# Altium schematic sheet Power.SchDoc
size A4; SheetNumber: 2; SheetTotal: 6
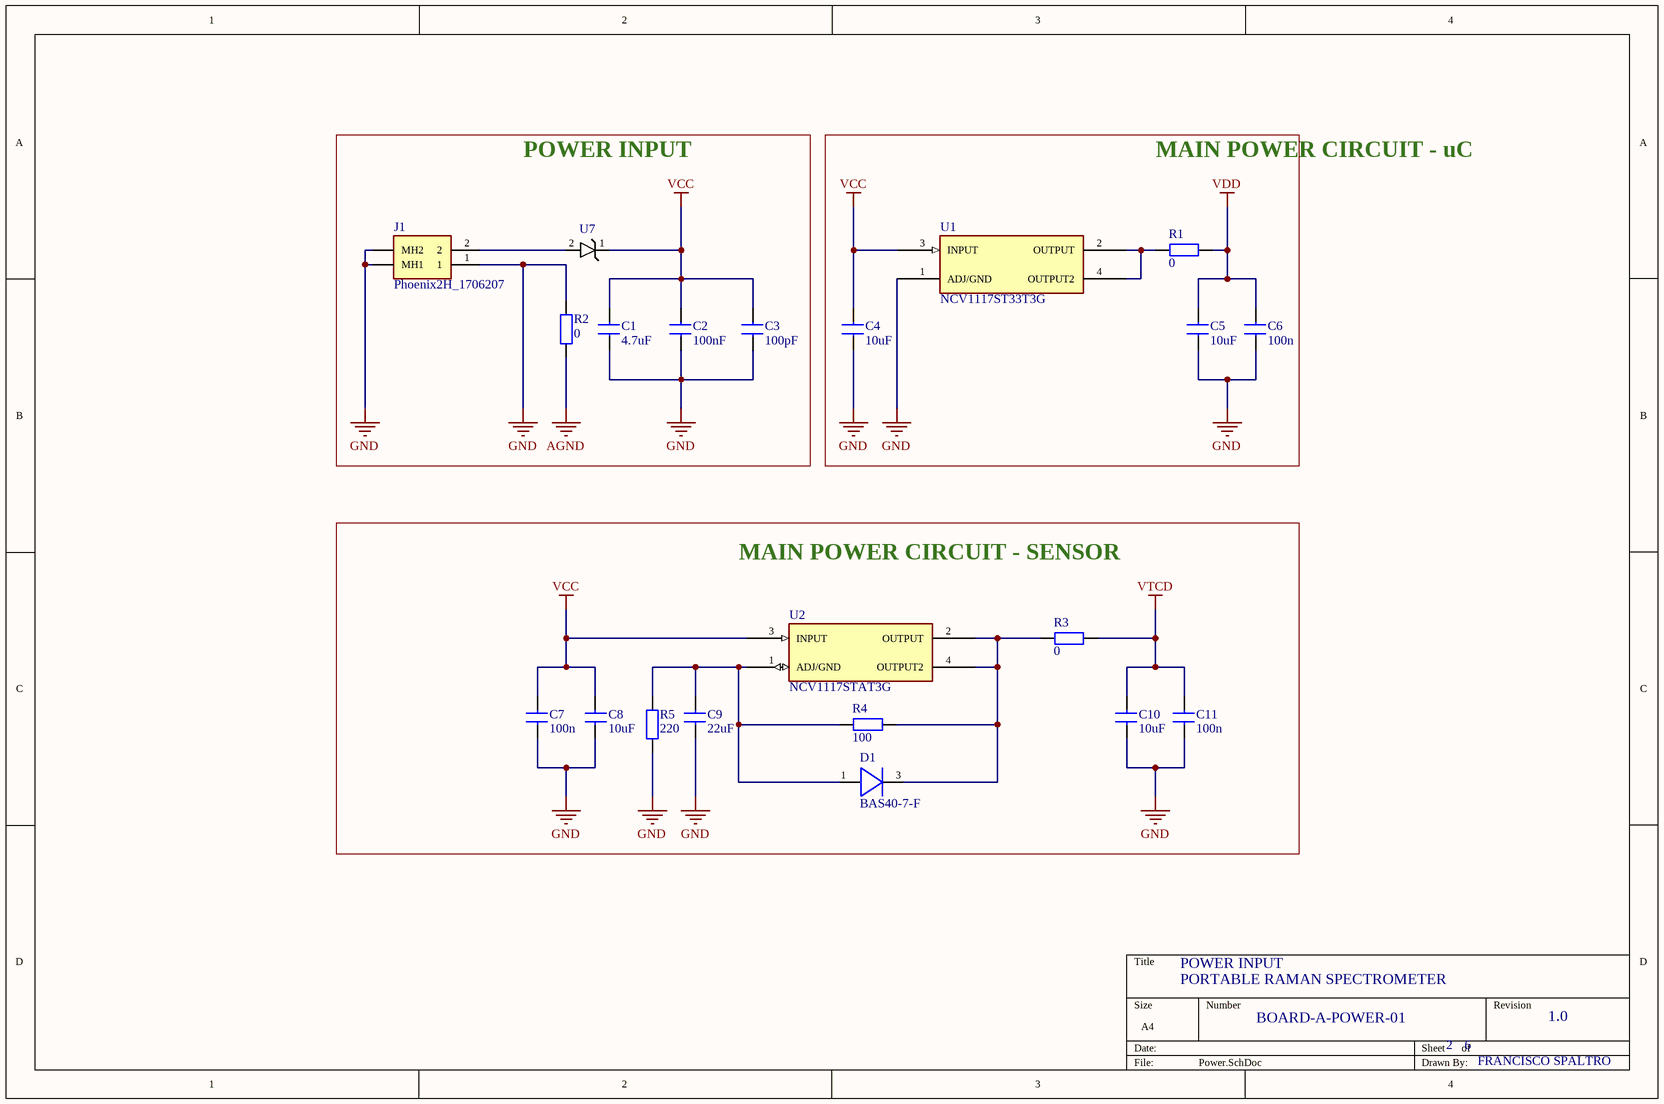
[diagram p0: Power.SchDoc]

## Parts
C1  4.7uF  [RES_0805]
C2  100nF  [RES_0805]
C3  100pF  [RES_0805]
C4  10uF  [RES_0805]
C5  10uF  [RES_0805]
C6  100n  [RES_0805]
C7  100n  [RES_0805]
C8  10uF  [RES_0805]
C9  22uF  [RES_0805]
C10  10uF  [RES_0805]
C11  100n  [RES_0805]
D1  BAS40-7-F  [SOT-23_DIO-M]
J1  Phoenix2H_1706207  [PHOENIX_1706207]
R1  0  [RES_0805]
R2  0  [RES_0805]
R3  0  [RES_0805]
R4  100  [RES_0805]
R5  220  [RES_0805]
U1  NCV1117ST33T3G  [SOT230P700X180-4N]
U2  NCV1117STAT3G  [SOT223-3_ONS-M]
U7  MBRA340T3G  [SMA_ONS]  (value not drawn)

## Blocks framed on the sheet
POWER INPUT: C1-C3 J1 R2 U7
MAIN POWER CIRCUIT - uC: C4-C6 R1 U1
MAIN POWER CIRCUIT - SENSOR: C7-C11 D1 R3-R5 U2

## Nets
AGND: R2.1
GND: C1.1 C2.1 C3.1 C4.1 C5.1 C6.1 C7.1 C8.1 C9.1 C10.1 C11.1 J1.1 J1.MH1 J1.MH2 R2.2 R5.1 U1.1(ADJ/GND)
VCC: C1.2 C2.2 C3.2 C4.2 C7.2 C8.2 U1.3(INPUT) U2.3(INPUT) U7.1(CATHODE)
VDD: C5.2 C6.2 R1.2
VTCD: C10.2 C11.2 R3.2
NetC9_2: C9.2 D1.1(A) R4.2 R5.2 U2.1(ADJ/GND)
NetD1_3: D1.3(C) R3.1 R4.1 U2.2(OUTPUT) U2.4(OUTPUT2)
NetJ1_2: J1.2 U7.2(ANODE)
NetR1_1: R1.1 U1.2(OUTPUT) U1.4(OUTPUT2)

## Notes on the sheet
- POWER INPUT
- PORTABLE RAMAN SPECTROMETER
- BOARD-A-POWER-01
- 2
- 6
- 1.0
- FRANCISCO SPALTRO

## Library data of the parts
C1-C11 = CAP_0805: Generic Capacitor
D1 = DIODE-BAS40-7-F: Description; Manufacturer_Name: Diodes Inc; Type: Diodes - Rectifiers, Single; Copyright: Copyright (C) 2025 Ultra Librarian. All rights reserved.; Manufacturer_Part_Number: BAS40-7-F; RefDes: RefDes
R1-R5 = RES_0805: Generic Capacitor
U1 = REG3_3-NCV1117ST33T3G: Linear Voltage Regulator IC Positive Fixed 1 Output 1A SOT-223; MF: ON Semiconductor; SnapEDA_Link: https://www.snapeda.com/parts/NCV1117ST33T3G/Onsemi/view-part/?ref=snap; Package: SOT-223-4 ON Semiconductor; Value: *; MP: NCV1117ST33T3G; Check_prices: https://www.snapeda.com/parts/NCV1117ST33T3G/Onsemi/view-part/?ref=eda
U2 = NCV1117STAT3G: Description; Manufacturer_Name: onsemi; Copyright: Copyright (C) 2025 Ultra Librarian. All rights reserved.; Manufacturer_Part_Number: NCV1117STAT3G; RefDes: RefDes; Type: Type
U7 = MBRA340T3G: Description; Manufacturer_Name: onsemi; Copyright: Copyright (C) 2025 Ultra Librarian. All rights reserved.; Manufacturer_Part_Number: MBRA340T3G; RefDes: RefDes; Type: Type
J1 = Phoenix2H_1706207: Package: None; Price: None; Value: *; MP: 1706207; Availability: Unavailable